# Altium schematic sheet 24V_to_5V_Buck_Converter.SchDoc
size A; SheetNumber: 1; SheetTotal: 1
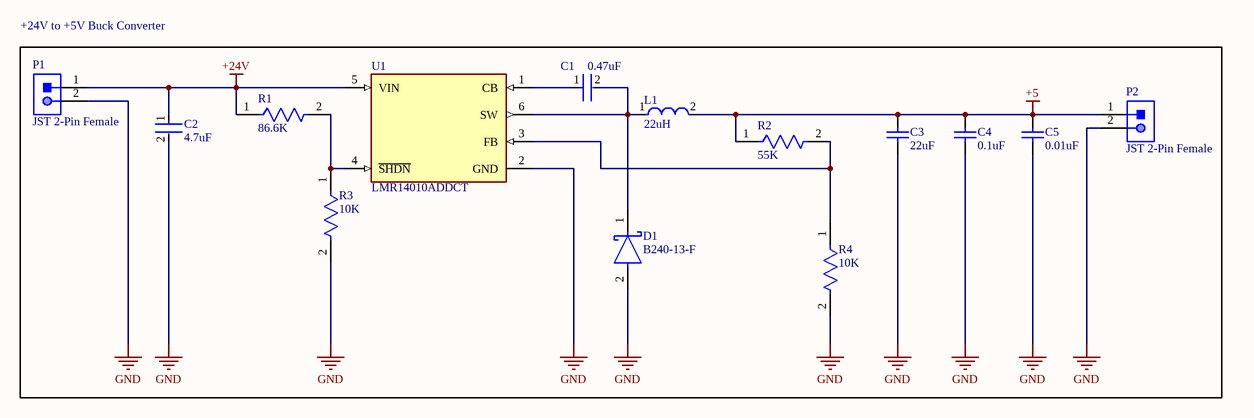
[diagram p0: 24V_to_5V_Buck_Converter.SchDoc]

## Parts
C1  0.47uF  [FP-CC0603-DA-MFG]
C2  4.7uF  [FP-CC1206-1_25-MFG]
C3  22uF  [CAPC1206(3216)190_L]
C4  0.1uF  [CAPC1206(3216)190_L]
C5  0.01uF  [CAPC1206(3216)190_L]
D1  B240-13-F  [FP-SMB-MFG]
L1  22uH  [FP-IHLP-2525CZ-FP_2_413x3-MFG]
P1  JST 2-Pin Female  [JST-S2B-PH-K-S_V]
P2  JST 2-Pin Female  [JST-S2B-PH-K-S_V]
R1  86.6K  [FP-RC0603-MFG]
R2  55K  [FP-RC0603-MFG]
R3  10K  [FP-RC0603-MFG]
R4  10K  [FP-RC0603-MFG]
U1  LMR14010ADDCT  [FP-DDC0006A-IPC_C]

## Blocks framed on the sheet
+24V to +5V Buck Converter: C1-C5 D1 L1 P1 P2 R1-R4 U1

## Nets
+5: C3.2 C4.2 C5.2 L1.2 P2.1 R2.1
+24V: C2.1 P1.1 R1.1 U1.5(VIN)
GND: C2.2 C3.1 C4.1 C5.1 D1.2(A) P1.2 P2.2 R3.2 R4.2 U1.2(GND)
NetC1_1: C1.1 U1.1(CB)
NetC1_2: C1.2 D1.1(C) L1.1 U1.6(SW)
NetR1_2: R1.2 R3.1 U1.4(~{SHDN})
NetR2_2: R2.2 R4.1 U1.3(FB)

## Library data of the parts
C1 = CMP-03422-000540-1: CAP CER 0.47UF 16V X7R 0603; Manufacturer Part Number: CC0603KRX7R7BB474; Manufacturer: YAGEO; Temperature Coefficient: 15%; Value: 470 nF; Tolerance: 0.1; Material: Ceramic; Device Class L1: Passive Components; Height: 0.9mm; Device Class L3: Ceramic Capacitors; Footprint Url: http://www.yageo.com/exep/pages/download/literatures/UPY-C_GEN_24.pdf; Automotive: No; Temperature Range High: +125°C; ComponentLink2Description: Datasheet; Temperature: -55°C to +125°C; Digikey Description: CAP CER 0.47UF 16V X7R 0603; Capacitance: 470 nF; Mouser Description: Multilayer Ceramic Capacitors MLCC - SMD/SMT 470nF 16V X7R 10%; Temperature Range Low: -55°C; RoHS: TRUE; Voltage: 16 V; Category: Cap; Lead Free: Yes; Device Class L2: Capacitors; Octopart: https://octopart.com/cc0603krx7r7bb474-yageo-8376533; Package: CC0603-DA; Voltage Rating: 16 V; Temperature Characteristic: X7R; ComponentLink2URL: http://www.yageo.com/documents/recent/UPY-GPHC_X7R_6.3V-to-50V_18.pdf
C2 = CMP-03422-000173-1: CAP CER 4.7UF 50V X7R 1206; Manufacturer Part Number: CC1206KKX7R9BB475; Manufacturer: Yageo; Automotive Grade: NA; Tolerance: 0.1; Temperature Coefficient: 15%; Material: Ceramic; Device Class L1: Passive Components; Category: Cap; Height: 1.45mm; Temperature Range Low: -55°C; Temperature Range High: +125°C; Package: CC1206-1.25; Lead Free: Yes; Temperature: -55°C to +125°C; RoHS: TRUE; Digikey Description: CAP CER 4.7UF 50V X7R 1206; Voltage Rating: 50 V; Device Class L2: Capacitors; Capacitance: 4.7 uF; Footprint Url: http://www.yageo.com/exep/pages/download/literatures/UPY-C_GEN_24.pdf; ComponentLink2URL: http://www.yageo.com/documents/recent/UPY-NP0X7R_HV_1KV-to-3KV_11.pdf; Temperature Characteristic: X7R; Mouser Description: CC Series 1206 4.7 uF 50 V ±10% Tolerance X7R Multilayer Ceramic Capacitor; ComponentLink2Description: Datasheet; Device Class L3: Ceramic Capacitors; Octopart: https://octopart.com/cc1206kkx7r9bb475-yageo-50417574; Value: 4.7 uF; Automotive: No
C3-C5 = CMP-1037-04994-1: CAP 22uF 16V -20% to +80% 1206 (3216 Metric) Thickness 1.9mm SMD; Case-Metric: 3216; Case-EIA: 1206; Max Thickness: 1.9 mm; Technology: SMT; Value: 22uF; Rated Voltage: 16 V; Tolerance: -20% to +80%
D1 = CMP-12790-000044-1: DIODE SCHOTTKY 40V 2A SMB; Manufacturer: Diodes Inc.; Capacitance: 200pF; Peak Reverse Current: 0.5mA; Max Junction Temp: +150°C; Value: 200pF; Max Surge Forward Current: 50A; Standoff Height: 0.05mm; Forward Current: 2A; Device Class L2: Diodes; Device Class L1: Discrete Semiconductors; Reverse Voltage: 40V; Automotive: No; Lead Free: Yes; Octopart: https://octopart.com/b240-13-f-diodes+inc.-325780; Device Class L3: Schottky Diodes; Temperature Range Low: -65°C; RoHS: TRUE; Category: Diode; Max Repetitive Reverse Voltage: 40V; Temperature: -65°C to +150°C; ComponentLink2URL: https://www.diodes.com/assets/Datasheets/ds13004.pdf; Manufacturer Part Number: B240-13-F; Mouser Description: Schottky Diodes & Rectifiers 40V 2A; Temperature Range High: +150°C; Package: SMB; ComponentLink2Description: Datasheet; Footprint Url: https://www.diodes.com/assets/Package-Files/SMB.pdf; Height: 2.5mm; Digikey Description: DIODE SCHOTTKY 40V 2A SMB
L1 = CMP-2000-06442-2: Commercial Inductors, Low DCR Series 22uH 2.9A 135mΩ 20%; Self Resonant Frequency: 1MHz; Shielding: Shielded; Core Material: Ferrite; DC Resistance (DCR): 135mR; Test Frequency: 100kHz; Saturation Current: 2.5A; Case/Package: 2525; Inductance Tolerance: 20%; Max DC Current: 2.9A; Inductance: 22uH; Termination: SMD/SMT; Case Code (Imperial): 2525; Mount: Surface Mount; Military Standard: Not; Min Operating Temperature: -55°C; RMS Current (Irms): 2.9A; Package Quantity: 2000; Max Operating Temperature: 125°C; Length: 7.24mm; Depth: 6.72mm; Packaging: Tape and Reel; Height: 3mm; Width: 0.255inch; Lead Free: Lead Free; Tolerance: 20%; Contact Plating: Tin; Current Rating: 2.9A; Number of Pins: 2; Case Code (Metric): 6363; Radiation Hardening: No; Height - Seated (Max): 0.118inch
P1 P2 = CMP-1755-00004-1: Male Header, Pitch 2 mm, 1 x 2 Position, Height 4.8 mm, Tail Length 3.4 mm, -25 to 85 degC, RoHS, Bulk; Case\Package: Radial; Tolerance: 20%; Capacitance: 10 uF; Voltage Rating (DC): 50 V; Packaging: Bulk; ComponentLink1URL: http://www.jst-mfg.com/product/pdf/eng/ePH.pdf; Radiation Hardening: No; Height: 11 mm; Package Quantity: 200; PackageDescription: Male Header, Pitch 2 mm, 1 x 2 Position, Height 4.8 mm, Tail Length 3.4 mm; PackageReference: S2B-PH-K-S; Diameter: 5 mm; Pins: 2; Mount: Through Hole; Max Operating Temperature: 85 degC; Min Operating Temperature: -40 degC; ComponentLink1Description: Datasheet; DatasheetVersion: Dec-12; Length: 11 mm; Lead Pitch: 2 mm; REACH SVHC: No SVHC; Voltage Rating: 50 V; RoHSCompliant: true
R1-R4 = CMP-2000-06925-2: RES SMD 0 OHM JUMPER 1/10W 0603; Manufacturer: Yageo; Manufacturer Part Number: RC0603FR-070RL; Tolerance: 1%; Value: 0Ω; Power Rating: 0.1W; Voltage Rating: 75V; Composition: Thick Film; Temperature Range Low: -55°C; Ipc Land Pattern Name: RESC16080X45; Lead Free: Yes; Digikey Description: RES SMD 0 OHM JUMPER 1/10W 0603; Height: 0.55mm; Automotive: No; Device Class L3: Chip SMD Resistors; Device Class L1: Passive Components; Device Class L2: Resistors; Footprint Url: http://www.yageo.com/exep/pages/download/literatures/PYu-R_Mount_10.pdf; Category: Res; Mouser Description: RC Series 0603 0.1 W 0 O Jumper Surface Mount Thick Film Chip Resistor; Resistance: 0Ω; ComponentLink2URL: http://www.yageo.com/documents/recent/PYu-RC_Group_51_RoHS_L_10.pdf; Series: RC_L; ComponentLink2Description: Datasheet; RoHS: TRUE; Temperature: -55°C to +155°C; Temperature Range High: +155°C; Package: RC0603; Octopart: https://octopart.com/rc0603fr-070rl-yageo-1180803
U1 = CMP-04918-000218-1: IC REG BUCK ADJ 1A TSOT23-6; Switching Frequency: 850kHz; Max Input Voltage: 40V; Synchronous Rectifier: No; Min Input Voltage: 4V; Output Type: Adjustable; Output Configuration: Positive; Number of Outputs: 1; Min Output Voltage: 765mV; Features: UVLO; Max Operating Temperature: 125°C; Min Operating Temperature: -40°C; Packaging: Tape and Reel; Case/Package: SOT-23-6; Max Output Voltage: 40V; RoHS Compliant: Yes; Output Current: 1A; Mount: Surface Mount